# EAGLE design Vboost (EAGLE 7.1.0)
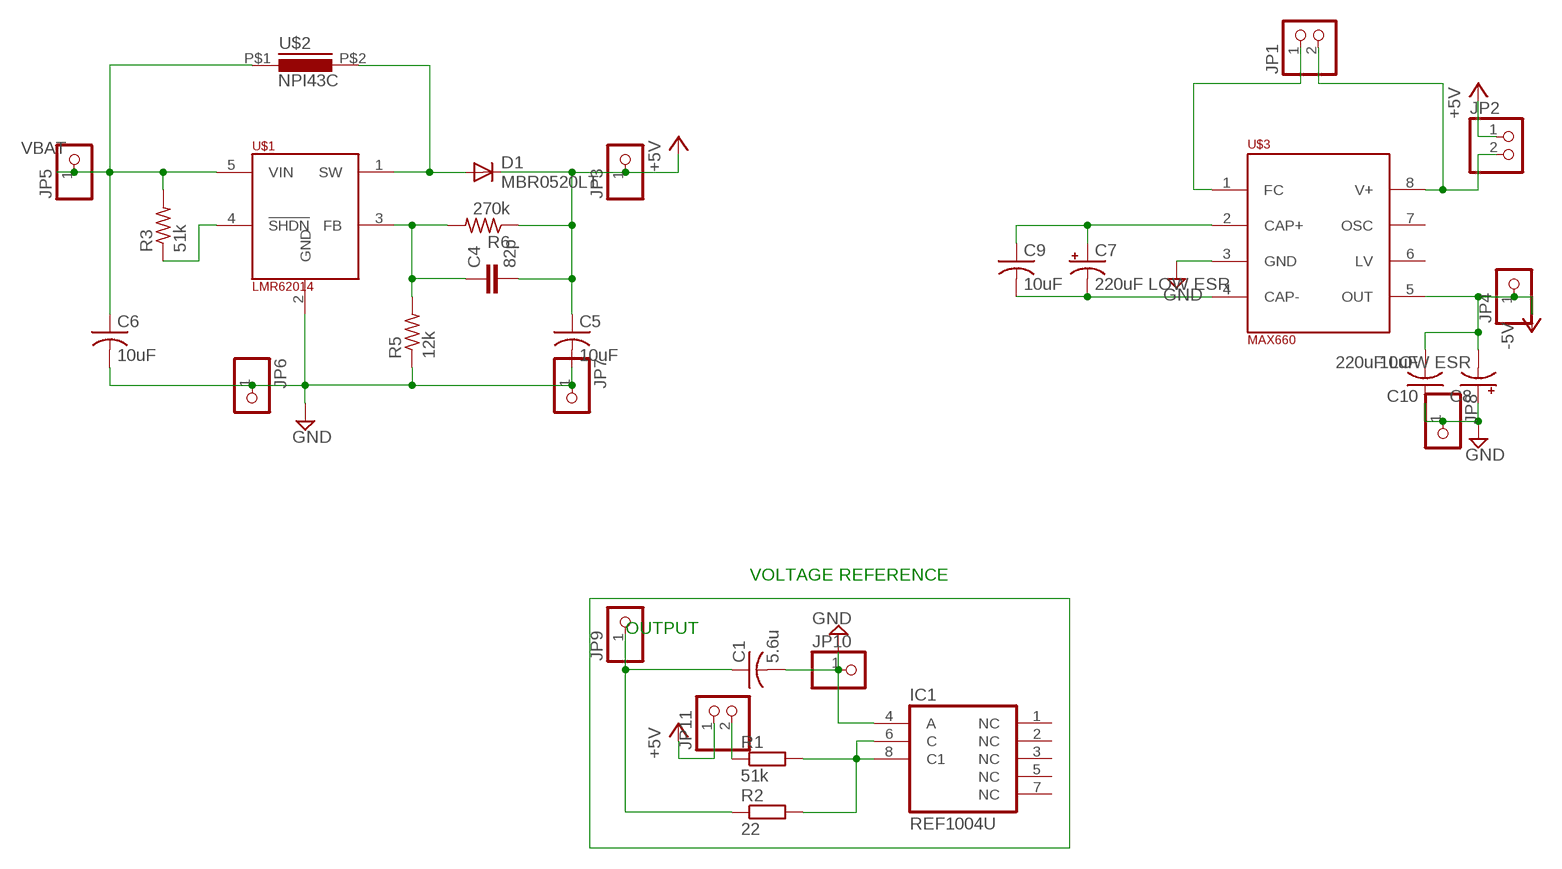
[diagram p0: schematic, sheet 1]

## Parts
C1  5.6u  C-USC0805K  [C0805K]
C4  82p  C-EUC0805  [C0805]
C5  10uF  C-USC0805  [C0805]
C6  10uF  C-USC0805  [C0805]
C7  220uF LOW ESR  CPOL-USD  [PANASONIC_D]
C8  220uF LOW ESR  CPOL-USD  [PANASONIC_D]
C9  10uF  C-USC0805  [C0805]
C10  10uF  C-USC0805  [C0805]
D1  MBR0520LT  [SOD123]
IC1  REF1004U  [SO08]
JP1  PINHD-1X2  [1X02]
JP2  PINHD-1X2  [1X02]
JP3  PINHD-1X1  [1X01]
JP4  PINHD-1X1  [1X01]
JP5  PINHD-1X1  [1X01]
JP6  PINHD-1X1  [1X01]
JP7  PINHD-1X1  [1X01]
JP8  PINHD-1X1  [1X01]
JP9  PINHD-1X1  [1X01]
JP10  PINHD-1X1  [1X01]
JP11  PINHD-1X2  [1X02]
R1  51k  R-EU_M0805  [M0805]
R2  22  R-EU_M0805  [M0805]
R3  51k  R-US_R0805  [R0805]
R5  12k  R-US_R0805  [R0805]
R6  270k  R-US_R0805  [R0805]
U$1  LMR62014  [SOT23-5]
U$2  NPI43C  [NPI43C]
U$3  MAX660  [SO08]

## Nets
+5V: C4.2 C5.1 D1.C JP2.1 JP3.1 JP11.1 R6.1
-5V: C8.- C10.2 JP4.1 U$3.5(OUT)
GND: C1.2 C5.2 C6.2 C8.+ C10.1 IC1.4(A) JP6.1 JP7.1 JP8.1 JP10.1 R5.1 U$1.2(GND) U$3.3(GND)
N$1: JP1.2 JP2.2 U$3.8(V+)
N$2: IC1.6(C) IC1.8(C1) R1.2 R2.2
N$3: C1.1 JP9.1 R2.1
N$5: C7.+ C9.1 U$3.2(CAP+)
N$6: JP11.2 R1.1
N$11: R3.1 U$1.4(!SHDN)
N$16: C7.- C9.2 U$3.4(CAP-)
N$17: C4.1 R5.2 R6.2 U$1.3(FB)
N$19: JP1.1 U$3.1(FC)
SW: D1.A U$1.1(SW) U$2.P$2
VBAT: C6.1 JP5.1 R3.2 U$1.5(VIN) U$2.P$1
Unconnected: IC1.1(NC) IC1.2(NC) IC1.3(NC) IC1.5(NC) IC1.7(NC) U$3.6(LV) U$3.7(OSC)

## Notes on the sheet
- VOLTAGE REFERENCE
- OUTPUT

## Library data of the parts
C1 = rcl:C-US: CAPACITOR, American symbol
C4 = resistor:C-EU: CAPACITOR, European symbol
C5 C6 C9 C10 = resistor:C-US: CAPACITOR, American symbol
C7 C8 = resistor:CPOL-US: POLARIZED CAPACITOR, American symbol
D1 = diode:MBR0520LT: SCHOTTKY BARRIER RECTIFIER Source: http://onsemi.com .. MBR0520LT1-D.pdf
IC1 = burr-brown:REF1004: Micropower Voltage Reference; MF: TEXAS INSTRUMENTS; MPN: REF1004C-1.2; OC_FARNELL: 1296022; OC_NEWARK: 75C7399
JP1 JP2 JP11 = pinhead:PINHD-1X2: PIN HEADER
JP3-JP10 = pinhead:PINHD-1X1: PIN HEADER
R1 R2 = resistor:R-EU_: RESISTOR, European symbol
R3 R5 R6 = resistor:R-US_: RESISTOR, American symbol
U$1 = RobThePyro:LMR62014
U$2 = RobThePyro:NPI43C
U$3 = RobThePyro:MAX660

## Board
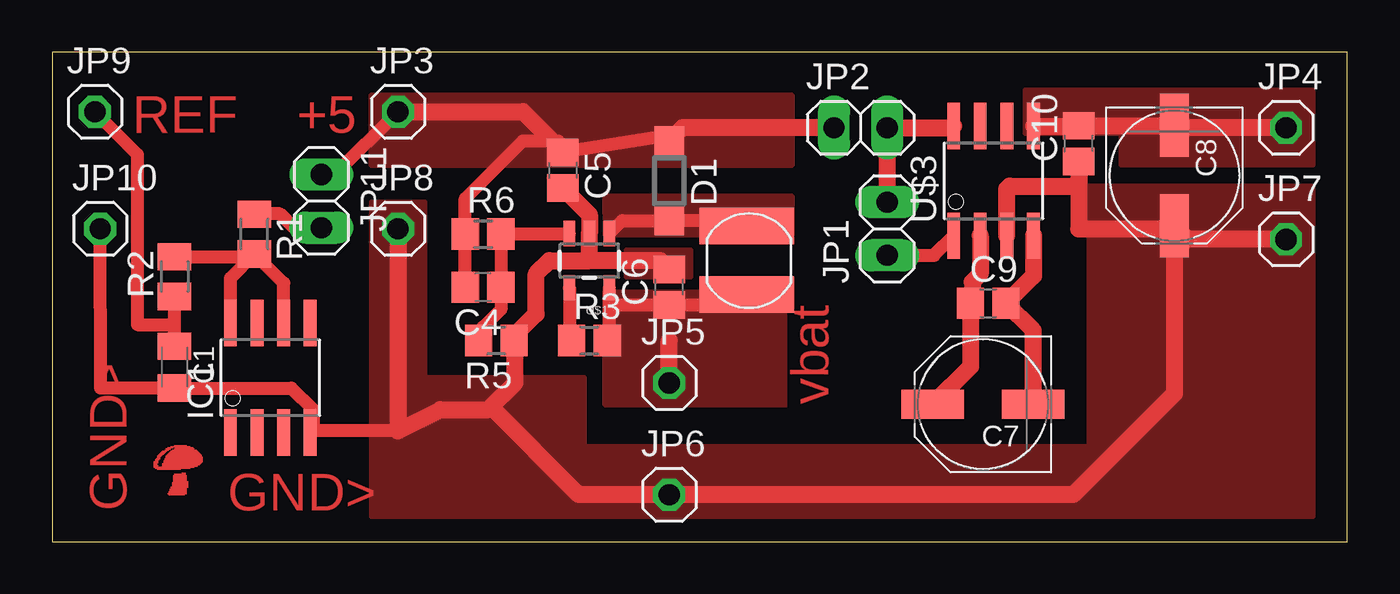
[diagram p1: board, top side]

Size 61.85 x 23.36 mm. Coordinates in mm from the lower left corner, seen from the top.
Outline: 0,0 61.85,0 61.85,23.36 0,23.36 0,0
Copper layers (1*16): Top 0.035mm / dielectric 1.5mm / Bottom 0.035mm
Design rules "default": minimum track width 10mil, minimum drill 24mil, track to track 8mil, track to pad 8mil, pad to pad 8mil, via to via 8mil, smd to smd 8mil, copper to edge 40mil, drill to drill 8mil, minimum pad ring 10mil, minimum via ring 8mil, stop-mask expansion 4mil, vias tented up to drill 0mil, thermal gap 10mil

### Footprints (pad centres in the part's own frame; a part is rotated, then mirrored left to right if it is on the bottom)
C0805K = smd 1.3 x 1.6: 1 -1,0; 2 1,0
C0805 = smd 1.3 x 1.5: 1 -0.85,0; 2 0.85,0
PANASONIC_D = smd 3 x 1.4: + 2.4,0; - -2.4,0
SOD123 = smd 1.4 x 1.4: A 1.9,0; C -1.9,0
SO08 = smd 0.61 x 2.21: 1 -1.905,-2.616; 2 -0.635,-2.616; 3 0.635,-2.616; 4 1.905,-2.616; 5 1.905,2.616; 6 0.635,2.616; 7 -0.635,2.616; 8 -1.905,2.616
1X02 = drill 1.016 long: 1 -1.27,0; 2 1.27,0
1X01 = drill 1.016 octagon: 1 0,0
M0805 = smd 1.3 x 1.6: 1 -0.95,0; 2 0.95,0
R0805 = smd 1.3 x 1.5: 1 -0.85,0; 2 0.85,0
SOT23-5 = smd 0.55 x 1.2: 1 -0.95,-1.3; 2 0,-1.3; 3 0.95,-1.3; 4 0.95,1.3; 5 -0.95,1.3
NPI43C = smd 1.75 x 4.5: P$1 -1.61,0.1; P$2 1.66,0.1

### Placement (x,y rotation side)
C1  5.84,8.33 270 top
C4  20.57,12.14 180 top
C5  24.38,17.73 270 top
C6  29.46,12.14 90 top
C7  44.45,6.55 180 top
C8  53.59,17.48 270 top
C9  44.7,11.38 0 top
C10  49.02,19 90 top
D1  29.46,17.22 270 top
IC1  10.41,7.82 0 top
JP1  39.88,14.94 90 top
JP2  38.61,19.76 0 top
JP3  16.51,20.52 0 top
JP4  58.93,19.76 0 top
JP5  29.46,7.57 0 top
JP6  29.46,2.24 0 top
JP7  58.93,14.43 0 top
JP8  16.51,14.94 0 top
JP9  2.03,20.52 0 top
JP10  2.29,14.94 0 top
JP11  12.85,16.26 270 top
R1  9.65,14.68 270 top
R2  5.84,12.65 90 top
R3  25.65,9.6 0 top
R5  21.21,9.6 180 top
R6  20.57,14.68 0 top
U$1  25.65,13.41 180 top
U$2  33.27,13.41 90 top
U$3  44.96,17.22 0 top

### Tracks (layer width: path | path; a pad name or v marks a point on that pad's centre or on a via)
+5V
  Top 0.61: D1.C 29.24,19.34 C5.1 24.17,19.13 23.88,19.13 22.48,19.13 19.72,16.37 R6.1 C4.2 | JP11.1 13.51,17.53 JP3.1
  Top 0.813: JP2.1 30.1,19.76 D1.C | JP3.1 22.48,20.52 23.88,19.13
  pour Top (no thermals): 15.24,17.98 35.31,17.98 35.31,21.29 15.24,21.29
-5V
  Top 0.813: U$3.5 49.01,19.84 C10.2 53.57,19.85 C8.- 53.71,19.76 JP4.1
  pour Top (no thermals): 46.48,19.51 51.05,19.51 51.05,17.98 60.2,17.98 60.2,21.54 46.48,21.54
GND
  Top 0.61: C6.2 29.04,13.41 | R5.1 22.06,9.82 | 16.51,5.28 12.39,5.28 | 12.39,5.28 12.45,5.33 12.45,6.3 11.41,7.33 C1.2 2.3,7.33 JP10.1 | 12.39,5.28 IC1.4
  Top 0.813: 29.04,13.41 25.65,13.41 | 25.65,13.41 U$1.2 25.65,15.61 C5.2 | 22.06,9.82 23.11,10.87 23.11,12.78 23.75,13.41 25.65,13.41 | C10.1 49.02,17.22 | 49.02,17.22 49.02,14.94 53.45,14.94 C8.+ | U$3.3 45.59,16.84 45.72,16.97 48.77,16.97 49.02,17.22 | JP8.1 16.51,5.28 18.54,6.3 20.83,6.3 20.95,6.43 | 20.95,6.43 22.1,7.57 22.1,9.56 R5.1 | 20.95,6.43 25.15,2.23 JP6.1 48.77,2.23 53.59,7.06 C8.+ | JP7.1 54.24,14.43 C8.+
  pour Top (no thermals): 27.43,12.65 30.48,12.65 30.48,13.92 27.43,13.92
  pour Top (no thermals): 60.2,16.97 60.2,1.22 15.24,1.22 15.24,16.21 17.78,16.21 17.78,7.82 25.4,7.82 25.4,4.52 49.53,4.52 49.53,16.97
N$1
  Top 0.813: U$3.8 42.98,19.76 JP2.2 JP1.2
N$2
  Top 0.61: R2.2 9.52,13.6 R1.2 | IC1.6 11.05,12.33 R1.2 | IC1.8 8.51,12.59 R1.2
N$3
  Top 0.61: C1.1 5.84,10.36 | 5.84,10.36 R2.1 | JP9.1 4.06,18.49 4.06,10.36 5.84,10.36
N$5
  Top 0.813: U$3.2 44.32,12.78 43.94,12.39 43.94,11.47 C9.1 43.85,8.36 C7.+
N$6
  Top 0.61: JP11.2 11.53,14.99 10.87,15.65 9.67,15.65 R1.1
N$11
  Top 0.61: U$1.4 24.7,9.7 R3.1
N$16
  Top 0.813: U$3.4 46.86,12.69 C9.2 46.85,10.08 C7.-
N$17
  Top 0.61: U$1.3 24.67,14.68 R6.2 C4.1 21.42,11.09 20.57,10.24 20.57,9.82 R5.2
N$19
  Top 0.61: JP1.1 42.11,13.66 U$3.1
SW
  Top 0.61: U$1.1 27.21,15.32 D1.A 32.92,15.32 U$2.P$2
  pour Top (no thermals): 26.42,14.68 35.31,14.68 35.31,16.46 26.42,16.46
VBAT
  Top 0.61: R3.2 26.6,9.6 26.6,11.29 | 26.6,11.29 U$1.5 | 26.6,11.29 C6.1 32.66,11.29 U$2.P$1
  Top 0.813: JP5.1 29.46,9.6
  pour Top (no thermals): 26.42,11.89 35.31,11.89 35.31,6.55 26.42,6.55
(copper drawn outside any net)
  shapes: Top area x62

### Text on the board
Top: REF | +5 | vbat | GND> | GND>